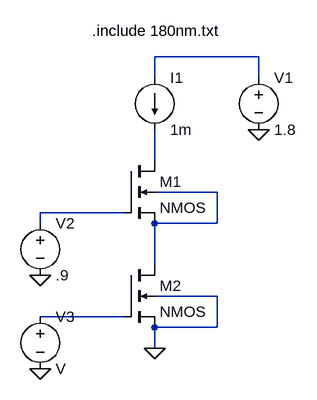
[diagram p0: schematic Draft12.asc]
Draft12.asc, the LTspice schematic file:
Version 4
SHEET 1 880 680
WIRE 352 -48 192 -48
WIRE 192 -16 192 -48
WIRE 352 -16 352 -48
WIRE 192 112 192 64
WIRE 288 160 192 160
WIRE 144 192 16 192
WIRE 16 208 16 192
WIRE 288 208 288 160
WIRE 288 208 192 208
WIRE 192 272 192 208
WIRE 288 320 192 320
WIRE 144 352 16 352
WIRE 288 368 288 320
WIRE 288 368 192 368
WIRE 192 400 192 368
FLAG 192 400 0
FLAG 16 288 0
FLAG 16 432 0
FLAG 352 64 0
SYMBOL nmos4 144 112 R0
SYMATTR InstName M1
SYMATTR Value2 l=.18u w=10u
SYMBOL nmos4 144 272 R0
SYMATTR InstName M2
SYMATTR Value2 l=.18u w=10u
SYMBOL current 192 -16 R0
WINDOW 123 0 0 Left 2
WINDOW 39 0 0 Left 2
SYMATTR InstName I1
SYMATTR Value 1m
SYMBOL voltage 352 -32 R0
WINDOW 123 0 0 Left 2
WINDOW 39 0 0 Left 2
SYMATTR InstName V1
SYMATTR Value 1.8
SYMBOL voltage 16 192 R0
WINDOW 123 0 0 Left 2
WINDOW 39 0 0 Left 2
SYMATTR InstName V2
SYMATTR Value .9
SYMBOL voltage 16 336 R0
SYMATTR InstName V3
TEXT 96 -88 Left 2 !.include 180nm.txt

The netlist it stands for:
* Draft12.asc
M1 N002 N004 N003 N003 NMOS l=.18u w=10u
M2 N003 N005 0 0 NMOS l=.18u w=10u
I1 N001 N002 1m
V1 N001 0 1.8
V2 N004 0 .9
V3 N005 0 V
.model NMOS NMOS
.model PMOS PMOS
.lib standard.mos
.include 180nm.txt
.backanno
.end